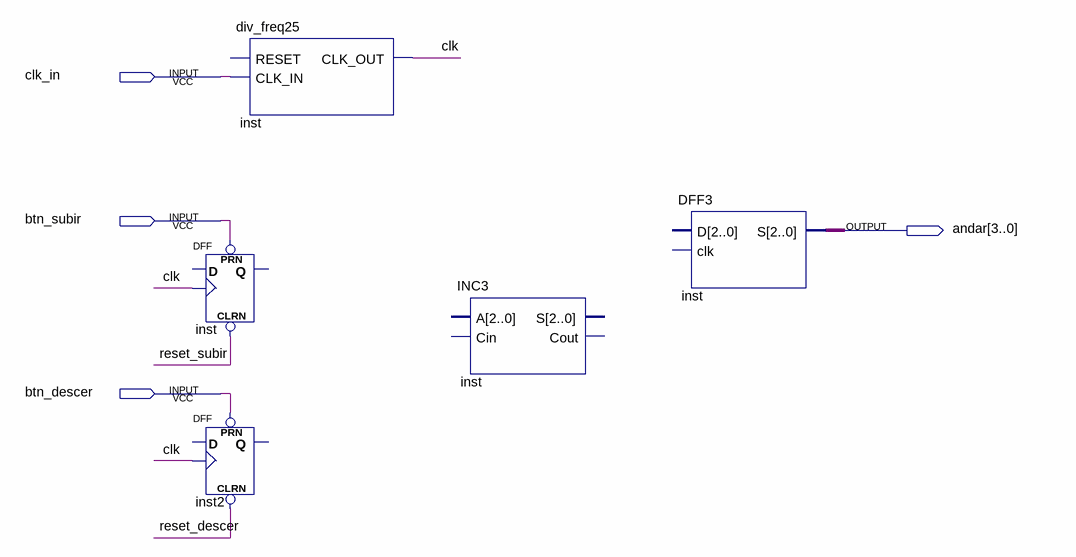
[diagram p0: schematic sheet]
// Quartus schematic Elevador.bdf as structural Verilog: 5 symbols, 4 pins
module Elevador (
  input  clk_in,
  input  btn_subir,
  input  btn_descer,
  output [3:0] andar
);

  wire clk, reset_descer, reset_subir;

  div_freq25 inst (.CLK_IN(clk_in), .CLK_OUT(clk));  // open: RESET
  DFF inst_dup2 (.CLRN(reset_subir), .CLK(clk), .PRN(btn_subir));  // open: D, Q
  DFF inst2 (.CLRN(reset_descer), .CLK(clk), .PRN(btn_descer));  // open: D, Q
  INC3 inst_dup3 ();  // open: A, Cin, S, Cout
  DFF3 inst_dup4 (.S(andar));  // open: D, clk
endmodule
